# Altium schematic sheet 10_FPGA_misc.SchDoc: FPGA misc
size A4; Organization: Lime Microsystems; Address1: Surrey Tech Centre; Address2: Guildford GU2 7YG; Address3: Surrey; Address4: United Kingdom; Revision: v1.2; SheetNumber: 10; SheetTotal: 16
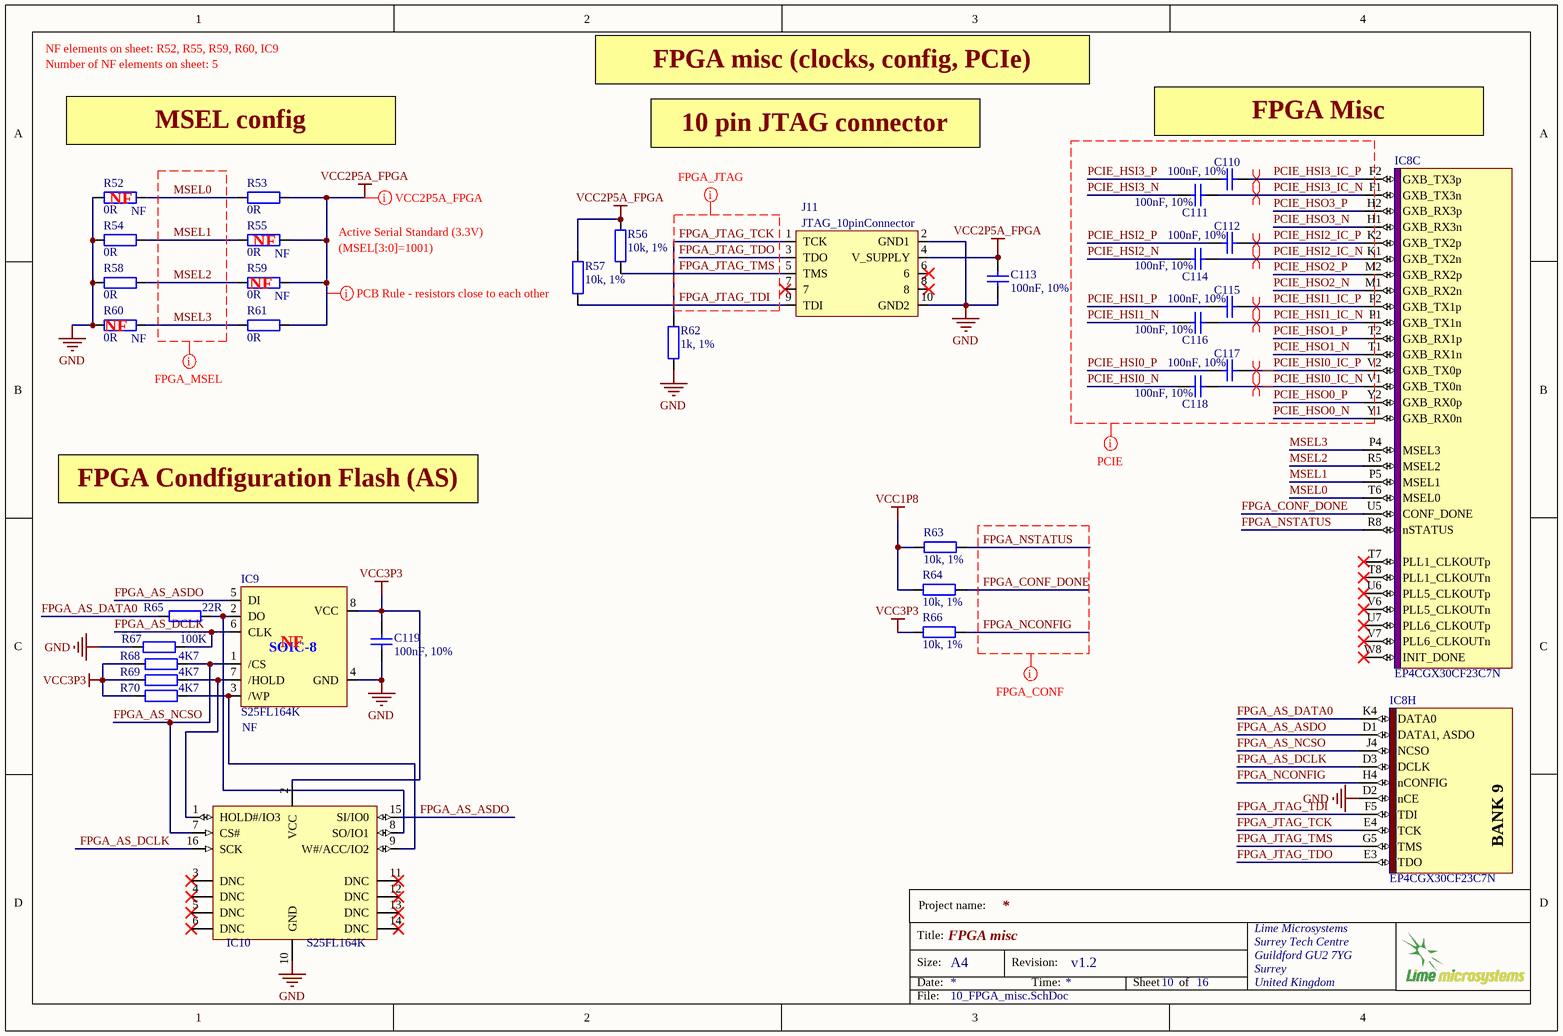
[diagram p0: 10_FPGA_misc.SchDoc]

## Parts
C110  100nF, 10%  [CAP0402]
C111  100nF, 10%  [CAP0402]
C112  100nF, 10%  [CAP0402]
C113  100nF, 10%  [CAP0402]
C114  100nF, 10%  [CAP0402]
C115  100nF, 10%  [CAP0402]
C116  100nF, 10%  [CAP0402]
C117  100nF, 10%  [CAP0402]
C118  100nF, 10%  [CAP0402]
C119  100nF, 10%  [CAP0402]
IC8  EP4CGX30CF23C7N  [ALTR-FBGA484_A-200]  (parts C,H of 10)
IC9  S25FL164K  Assembly Info: NF  [M25P40-VMN6TPB_SO8N]
IC10  S25FL164K  [SOIC16_WIDE]
J11  JTAG_10pinConnector  [HEADER5x2_SM]
R52  0R  Assembly Info: NF  [RES0402]
R53  0R  [RES0402]
R54  0R  [RES0402]
R55  0R  Assembly Info: NF  [RES0402]
R56  10k, 1%  [RES0402]
R57  10k, 1%  [RES0402]
R58  0R  [RES0402]
R59  0R  Assembly Info: NF  [RES0402]
R60  0R  Assembly Info: NF  [RES0402]
R61  0R  [RES0402]
R62  1k, 1%  [RES0402]
R63  10k, 1%  [RES0402]
R64  10k, 1%  [RES0402]
R65  22R  [RES0402]
R66  10k, 1%  [RES0402]
R67  100K  [RES0402]
R68  4K7  [RES0402]
R69  4K7  [RES0402]
R70  4K7  [RES0402]

## Nets
GND: C113.2 C119.2 IC8.D2(nCE) IC9.4(GND) IC10.10(GND) J11.2(GND1) J11.10(GND2) R52.2 R54.2 R58.2 R60.2 R62.2 R67.2
VCC1P8: R63.1 R64.1
VCC2P5A_FPGA: C113.1 J11.4(V_SUPPLY) R53.1 R55.1 R56.1 R57.1 R59.1 R61.1
VCC3P3: C119.1 IC9.8(VCC) IC10.2(VCC) R66.1 R68.1 R69.1 R70.1
FPGA_AS_ASDO: IC8.D1(DATA1,_ASDO) IC9.5(DI) IC10.15(SI/IO0)
FPGA_AS_DATA0: IC8.K4(DATA0) R65.2
FPGA_AS_DCLK: IC8.D3(DCLK) IC9.6(CLK) IC10.16(SCK) R67.1
FPGA_AS_NCSO: IC8.J4(NCSO) IC9.1(/CS) IC10.7(CS#) R68.2
FPGA_CONF_DONE: IC8.U5(CONF_DONE) R64.2
FPGA_JTAG_TCK: IC8.E4(TCK) J11.1(TCK) R62.1
FPGA_JTAG_TDI: IC8.F5(TDI) J11.9(TDI) R57.2
FPGA_JTAG_TDO: IC8.E3(TDO) J11.3(TDO)
FPGA_JTAG_TMS: IC8.G5(TMS) J11.5(TMS) R56.2
FPGA_NCONFIG: IC8.H4(nCONFIG) R66.2
FPGA_NSTATUS: IC8.R8(nSTATUS) R63.2
MSEL0: IC8.T6(MSEL0) R52.1 R53.2
MSEL1: IC8.P5(MSEL1) R54.1 R55.2
MSEL2: IC8.R5(MSEL2) R58.1 R59.2
MSEL3: IC8.P4(MSEL3) R60.1 R61.2
PCIE_HSI0_IC_N: C118.1 IC8.V1(GXB_TX0n)
PCIE_HSI0_IC_P: C117.1 IC8.V2(GXB_TX0p)
PCIE_HSI0_N: C118.2
PCIE_HSI0_P: C117.2
PCIE_HSI1_IC_N: C116.1 IC8.P1(GXB_TX1n)
PCIE_HSI1_IC_P: C115.1 IC8.P2(GXB_TX1p)
PCIE_HSI1_N: C116.2
PCIE_HSI1_P: C115.2
PCIE_HSI2_IC_N: C114.1 IC8.K1(GXB_TX2n)
PCIE_HSI2_IC_P: C112.1 IC8.K2(GXB_TX2p)
PCIE_HSI2_N: C114.2
PCIE_HSI2_P: C112.2
PCIE_HSI3_IC_N: C111.1 IC8.F1(GXB_TX3n)
PCIE_HSI3_IC_P: C110.1 IC8.F2(GXB_TX3p)
PCIE_HSI3_N: C111.2
PCIE_HSI3_P: C110.2
PCIE_HSO0_N: IC8.Y1(GXB_RX0n)
PCIE_HSO0_P: IC8.Y2(GXB_RX0p)
PCIE_HSO1_N: IC8.T1(GXB_RX1n)
PCIE_HSO1_P: IC8.T2(GXB_RX1p)
PCIE_HSO2_N: IC8.M1(GXB_RX2n)
PCIE_HSO2_P: IC8.M2(GXB_RX2p)
PCIE_HSO3_N: IC8.H1(GXB_RX3n)
PCIE_HSO3_P: IC8.H2(GXB_RX3p)
NetIC9_2: IC9.2(DO) IC10.8(SO/IO1) R65.1
NetIC9_3: IC9.3(/WP) IC10.9(W#/ACC/IO2) R70.2
NetIC9_7: IC9.7(/HOLD) IC10.1(HOLD#/IO3) R69.2

Not connected (* = marked no-connect by the designer): IC8 T7(PLL1_CLKOUTp)* T8(PLL1_CLKOUTn)* U6(PLL5_CLKOUTp)* U7(PLL6_CLKOUTp)* V6(PLL5_CLKOUTn)* V7(PLL6_CLKOUTn)* W8(INIT_DONE)*; IC10 3(DNC)* 4(DNC)* 5(DNC)* 6(DNC)* 11(DNC)* 12(DNC)* 13(DNC)* 14(DNC)*; J11 6* 7* 8*

## Layout directives
net class FPGA_JTAG: FPGA_JTAG_TCK, FPGA_JTAG_TDI, FPGA_JTAG_TDO, FPGA_JTAG_TMS
net class FPGA_CONF: FPGA_CONF_DONE, FPGA_NCONFIG, FPGA_NSTATUS
rule Undefined: VCC2P5A_FPGA
net class FPGA_MSEL: MSEL0, MSEL1, MSEL2, MSEL3
differential pair: PCIE_HSI0_IC_N, PCIE_HSI0_IC_P, PCIE_HSI1_IC_N, PCIE_HSI1_IC_P, PCIE_HSI2_IC_N, PCIE_HSI2_IC_P, PCIE_HSI3_IC_N, PCIE_HSI3_IC_P
net class PCIE: PCIE_HSI0_IC_N, PCIE_HSI0_IC_P, PCIE_HSI0_N, PCIE_HSI0_P, PCIE_HSI1_IC_N, PCIE_HSI1_IC_P, PCIE_HSI1_N, PCIE_HSI1_P, PCIE_HSI2_IC_N, PCIE_HSI2_IC_P, PCIE_HSI2_N, PCIE_HSI2_P, PCIE_HSI3_IC_N, PCIE_HSI3_IC_P, PCIE_HSI3_N, PCIE_HSI3_P, PCIE_HSO0_N, PCIE_HSO0_P, PCIE_HSO1_N, PCIE_HSO1_P, PCIE_HSO2_N, PCIE_HSO2_P, PCIE_HSO3_N, PCIE_HSO3_P
net class VCC2P5A_FPGA: VCC2P5A_FPGA

## Notes on the sheet
- NF elements on sheet: R52, R55, R59, R60, IC9
- Number of NF elements on sheet: 5
- FPGA misc (clocks, config, PCIe)
- MSEL config
- 10 pin JTAG connector
- FPGA Misc
- (near R52) NF
- (near R55) NF
- Active Serial Standard (3.3V)
- (near R59) NF
- (MSEL[3:0]=1001)
- (near R60) NF
- FPGA Condfiguration Flash (AS)
- (near IC9) NF
- Project name:
- Title:
- Size:
- Date:
- A4
- Revision:
- Time:
- Sheet
- of
- File:
- (in symbol EP4CGX30CF23C7N, part H) BANK 9
- (in symbol W25Q32FV) SOIC-8

## Library data of the parts
C110 = Cap_0603: Part Description: 0.10µF ±10% 16V X7R Ceramic Capacitor -55°C ~ 125°C Surface Mount, MLCC 0402 (1005 Metric) 0.039" L x 0.020" W (1.00mm x 0.50mm); Manufacturer Part Number 1: GRM155R71C104KA88D; Brand: Murata Electronics; Type: General Purpose MLCC; Capacitance: 0.1 uF; Temperature Coefficient / Code: +/- 15 %; Voltage Rating DC: 16 V; Case Height: 0.5 mm; Case Length: 1 mm; Dielectric: X7R; Supplier 1: Mouser; Supplier Part Number 1: 81-GRM155R71C104KA88; Tolerance: 10 %; Case Code - in: 0402; Manufacturer: Murata Electronics; Category: Multilayer Ceramic Capacitors MLCC - SMD/SMT; Value: 100nF, 10%; Case Code - mm: 1005; Case Width: 0.5 mm; Manufacturer Part Number: GRM155R71C104KA88D; Maximum Operating Temperature: + 125 C; Minimum Operating Temperature: - 55 C; Minimum Order Quantity: 1; Operating Temperature Range: - 55 C to + 125 C; Package / Case: 0402 (1005 metric); Packaging: Reel; Product: General Type MLCCs; Product Category: Low & Medium Capacitance SMD Ceramic Chip Capacitors; Reeling: True; RoHS - Mouser: Y; RoHS: RoHS Compliant; Series: GRM; Standard Pack Qty: 10000; Termination Style: SMD/SMT
C111-C118 = Cap_0603: Part Description: 0.10µF ±10% 16V X7R Ceramic Capacitor -55°C ~ 125°C Surface Mount, MLCC 0402 (1005 Metric) 0.039" L x 0.020" W (1.00mm x 0.50mm); Manufacturer Part Number 1: GRM155R71C104KA88D; Brand: Murata Electronics; Type: General Purpose MLCC; Capacitance: 0.1 uF; Temperature Coefficient / Code: +/- 15 %; Voltage Rating DC: 16 V; Supplier 1: Mouser; Supplier Part Number 1: 81-GRM155R71C104KA88; Tolerance: 10 %; Case Code - in: 0402; Manufacturer: Murata Electronics; Category: Multilayer Ceramic Capacitors MLCC - SMD/SMT; Value: 100nF, 10%; Manufacturer Part Number: GRM155R71C104KA88D; Maximum Operating Temperature: + 125 C; Minimum Operating Temperature: - 55 C; Minimum Order Quantity: 1; Operating Temperature Range: - 55 C to + 125 C; Package / Case: 0402 (1005 metric); Packaging: Reel; Product: General Type MLCCs; Product Category: Low & Medium Capacitance SMD Ceramic Chip Capacitors; Reeling: True; RoHS - Mouser: Y; RoHS: RoHS Compliant; Series: GRM; Standard Pack Qty: 10000; Termination Style: SMD/SMT
C119 = Cap_0603: Manufacturer Part Number 1: GRM155R71C104KA88D; Part Description: 0.10µF ±10% 16V X7R Ceramic Capacitor -55°C ~ 125°C Surface Mount, MLCC 0402 (1005 Metric) 0.039" L x 0.020" W (1.00mm x 0.50mm); Brand: Murata Electronics; Type: General Purpose MLCC; Capacitance: 0.1 uF; Temperature Coefficient / Code: +/- 15 %; Voltage Rating DC: 16 V; Supplier 1: Mouser; Supplier Part Number 1: 81-GRM155R71C104KA88; Tolerance: 10 %; Case Code - in: 0402; Manufacturer: Murata Electronics; Category: Multilayer Ceramic Capacitors MLCC - SMD/SMT; Value: 100nF, 10%; Manufacturer Part Number: GRM155R71C104KA88D; Maximum Operating Temperature: + 125 C; Minimum Operating Temperature: - 55 C; Minimum Order Quantity: 1; Operating Temperature Range: - 55 C to + 125 C; Package / Case: 0402 (1005 metric); Packaging: Reel; Product: General Type MLCCs; Product Category: Low & Medium Capacitance SMD Ceramic Chip Capacitors; Reeling: True; RoHS - Mouser: Y; RoHS: RoHS Compliant; Series: GRM; Standard Pack Qty: 10000; Termination Style: SMD/SMT
IC8 = EP4CGX30CF23C7N: Manufacturer: Altera; Part Description: IC FPGA 290 I/O 484FBGA; Voltage - Supply: 1.16 V ~ 1.24 V; Number of I/O: 290; Total RAM Bits: 1105920; Number of Logic Elements/Cells: 29440; Number of LABs/CLBs: 1840; Supplier 1: Digi-Key; Package / Case: 484-BGA; Operating Temperature: 0°C ~ 85°C; Mounting Type: Surface Mount; Number of Gates: -; Supplier Device Package: 484-FBGA (23x23); Category: Integrated Circuits (ICs); RoHS: RoHS Compliant; Supplier Part Number 1: 544-2730-ND; Manufacturer Part Number 1: EP4CGX30CF23C7N
IC9 = W25Q32FV: Manufacturer: Cypress Semiconductor Corp; Manufacturer Part Number 1: S25FL164K0XMFI011; Part Description: IC FLASH 64MBIT 8SO; Voltage - Supply: 2.7 V ~ 3.6 V; Memory Type: FLASH - NOR; Interface: SPI Serial; Memory Size: 64M (8M x 8); Speed: 108MHz; Format - Memory: FLASH; Supplier 1: Digi-Key; Supplier Part Number 1: 1274-1097-ND; Packaging: Tube; Category: Integrated Circuits (ICs); RoHS: RoHS Compliant; Operating Temperature: -40°C ~ 85°C (TA); Package / Case: 8-SOIC (0.209", 5.30mm Width); Supplier Device Package: 8-SO
IC10 = S25FL032P: Manufacturer: Cypress Semiconductor Corp; Manufacturer Part Number 1: S25FL164K0XMFI003; Description: IC FLASH 64MBIT 108MHZ 16SOIC; Format - Memory: FLASH; Memory Type: FLASH - NOR; Memory Size: 64M (8M x 8); Speed: 108MHz; Interface: SPI Serial; Voltage - Supply: 2.7 V ~ 3.6 V; Supplier 1: Digi-Key; Supplier Part Number 1: 1274-1109-1-ND; RoHS: RoHS Compliant; Category: Integrated Circuits (ICs); Stock 1: 2398; Pricing 1: 1=1.27, 10=1.157, 25=1.1256, 50=1.1196, 100=1.0009, 250=0.99792, 500=0.98308 (USD); Packaging: Cut Tape (CT); Part Status: Active; Operating Temperature: -40°C ~ 85°C (TA); Package / Case: 16-SOIC (0.295", 7.50mm Width); Supplier Device Package: 16-SO; ComponentLink1URL: http://www.cypress.com/file/196886/download; ComponentLink1Description: http://www.cypress.com/file/196886/download
J11 = JTAG_connector_10pin: Manufacturer Part Number 1: 54202-G0805LF; Part Description: 10 Positions Header, Unshrouded Connector 0.100" (2.54mm) Surface Mount Gold or Gold, GXT; Manufacturer: MOLEX; Connector Type: Header, Unshrouded; Number of Positions: 10; Number of Positions Loaded: All; Supplier 1: Digi-Key; Supplier Part Number 1: 609-4723-ND; Contact Type: Male Pin; Category: Connectors, Interconnects; Contact Finish: Gold or Gold, GXT™; Color: Black; Number of Rows: 2; Mounting Type: Surface Mount
R52-R55 R58-R61 = Res_0402: Manufacturer: Yageo; Part Description: RES SMD 0.0OHM JUMPER 1/16W 0402; Supplier 1: Digi-Key; Supplier Part Number 1: 311-0.0JRTR-ND; Composition: Thick Film; Package / Case: 0402 (1005 Metric); Category: Resistors; Value: 0R
R56 R57 R63 R64 R66 = Res_0402: Manufacturer: Yageo; Manufacturer Part Number 1: RC0402FR-0710KL; Part Description: RES SMD 10K OHM 1% 1/16W 0402; Temperature Coefficient: ±100ppm/°C; Power (Watts): 0.063W, 1/16W; Value: 10k, 1%; Supplier 1: Digi-Key; Supplier Part Number 1: 311-10.0KLRTR-ND; Resistance (Ohms): 10k; Packaging: Tape & Reel (TR); RoHS: RoHS Compliant; Package / Case: 0402 (1005 Metric); Tolerance: ±1%; Operating Temperature: -55°C ~ 155°C; Size / Dimension: 0.039" L x 0.020" W (1.00mm x 0.50mm); Number of Terminations: 2; Category: Resistors; Height: 0.016" (0.40mm); Supplier Device Package: 0402; Features: Moisture Resistant; Composition: Thick Film
R62 = Res_0402: Manufacturer: Stackpole Electronics Inc; Manufacturer Part Number 1: RMCF0402FT1K00; Part Description: RES SMD 1K OHM 1% 1/16W 0402; Temperature Coefficient: ±100ppm/°C; Power (Watts): 0.063W, 1/16W; Value: 1k, 1%; Supplier 1: Digi-Key; Supplier Part Number 1: RMCF0402FT1K00TR-ND; Package / Case: 0402 (1005 Metric); Supplier Device Package: 0402; Height: 0.016" (0.40mm); Size / Dimension: 0.039" L x 0.020" W (1.00mm x 0.50mm); Number of Terminations: 2; Packaging: Cut Tape (CT); Category: Resistors; Composition: Thick Film; Resistance (Ohms): 1k; Tolerance: ±1%; Features: Moisture Resistant; Operating Temperature: -55°C ~ 155°C; RoHS: RoHS Compliant
R65 = Res_0402: Part Description: RES SMD 22 OHM 1% 1/16W 0402; Manufacturer: Yageo; Tolerance: ±1%; Temperature Coefficient: ±100ppm/°C; Resistance (Ohms): 22; Supplier 1: Digi-Key; Supplier Part Number 1: 311-22.0LRTR-ND; Supplier Device Package: 0402; Composition: Thick Film; Category: Resistors; Value: 22R
R67 = Res_0402: Manufacturer Part Number 1: ERJ-2GEJ104X; Manufacturer: Panasonic Electronic Components; Part Description: RES SMD 100K OHM 5% 1/10W 0402; Tolerance: ±5%; Temperature Coefficient: ±200ppm/°C; Power (Watts): 0.1W, 1/10W; Supplier 1: Digi-Key; Supplier Part Number 1: P100KJCT-ND; Resistance (Ohms): 100k; Composition: Thick Film; Features: Automotive AEC-Q200; Number of Terminations: 2; Height: 0.016" (0.40mm); RoHS: RoHS Compliant; Package / Case: 0402 (1005 Metric); Packaging: Cut Tape (CT); Size / Dimension: 0.039" L x 0.020" W (1.00mm x 0.50mm); Supplier Device Package: 0402; Operating Temperature: -55°C ~ 155°C; Category: Resistors; value: 100K
R68-R70 = Res_0402: Manufacturer Part Number 1: RMCF0402JT4K70; Part Description: RES SMD 4.7K OHM 5% 1/16W 0402; Manufacturer: Stackpole Electronics Inc.; Temperature Coefficient: ±100ppm/°C; Resistance(Ohms): 4.7k; Tolerance: ±5%; Supplier 1: Digi-Key; Composition: Thick Film; Supplier Device Package: 0402; Supplier: Digi-Key; Supplier Part Number 1: RMCF0402JT4K70TR-ND; Category: Resistors; Value: 4K7